# EAGLE design carlos_reg_psu (EAGLE 7.3.0)
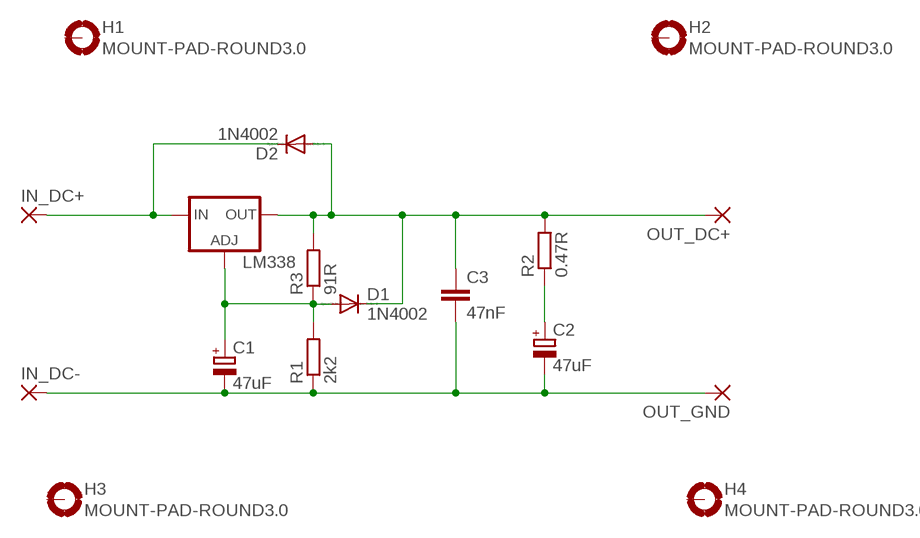
[diagram p0: schematic, sheet 1]

## Parts
C1  47uF  CPOL-EUE5-13  [E5-13]
C2  47uF  CPOL-EUE5-13  [E5-13]
C3  47nF  C-EU050-030X075  [C050-030X075]
D1  1N4002  1N4004  [DO41-10]
D2  1N4002  1N4004  [DO41-10]
H1  MOUNT-PAD-ROUND3.0  [3,0-PAD]
H2  MOUNT-PAD-ROUND3.0  [3,0-PAD]
H3  MOUNT-PAD-ROUND3.0  [3,0-PAD]
H4  MOUNT-PAD-ROUND3.0  [3,0-PAD]
IN_DC+  2,54/1,0  [2,54/1,0]
IN_DC-  2,54/1,0  [2,54/1,0]
LM338  LM317TS  [317TS]
OUT_DC+  2,54/1,0  [2,54/1,0]
OUT_GND  2,54/1,0  [2,54/1,0]
R1  2k2  R-EU_0414/5V  [0414V]
R2  0.47R  R-EU_0414/5V  [0414V]
R3  91R  R-EU_0414/5V  [0414V]

## Nets
N$1: C2.+ R2.1
N$2: C1.+ D1.A LM338.1(ADJ) R1.2 R3.1
N$3: C3.1 D1.C D2.A LM338.2(OUT) OUT_DC+.1(P) R2.2 R3.2
N$4: D2.C IN_DC+.1(P) LM338.3(IN)
N$6: C1.- C2.- C3.2 IN_DC-.1(P) OUT_GND.1(P) R1.1
Unconnected: H1.B3,0(MOUNT) H2.B3,0(MOUNT) H3.B3,0(MOUNT) H4.B3,0(MOUNT)

## Library data of the parts
C1 C2 = resistor:CPOL-EU: POLARIZED CAPACITOR, European symbol
C3 = rcl:C-EU: CAPACITOR, European symbol
D1 D2 = diode:1N4004: DIODE general purpose rectifier, 1 A
H1-H4 = holes:MOUNT-PAD-ROUND: MOUNTING PAD, round
IN_DC+ IN_DC- OUT_DC+ OUT_GND = wirepad:2,54/1,0: THROUGH-HOLE PAD
LM338 = v-reg:LM317TS: VOLTAGE REGULATOR
R1-R3 = resistor:R-EU_: RESISTOR, European symbol

## Board
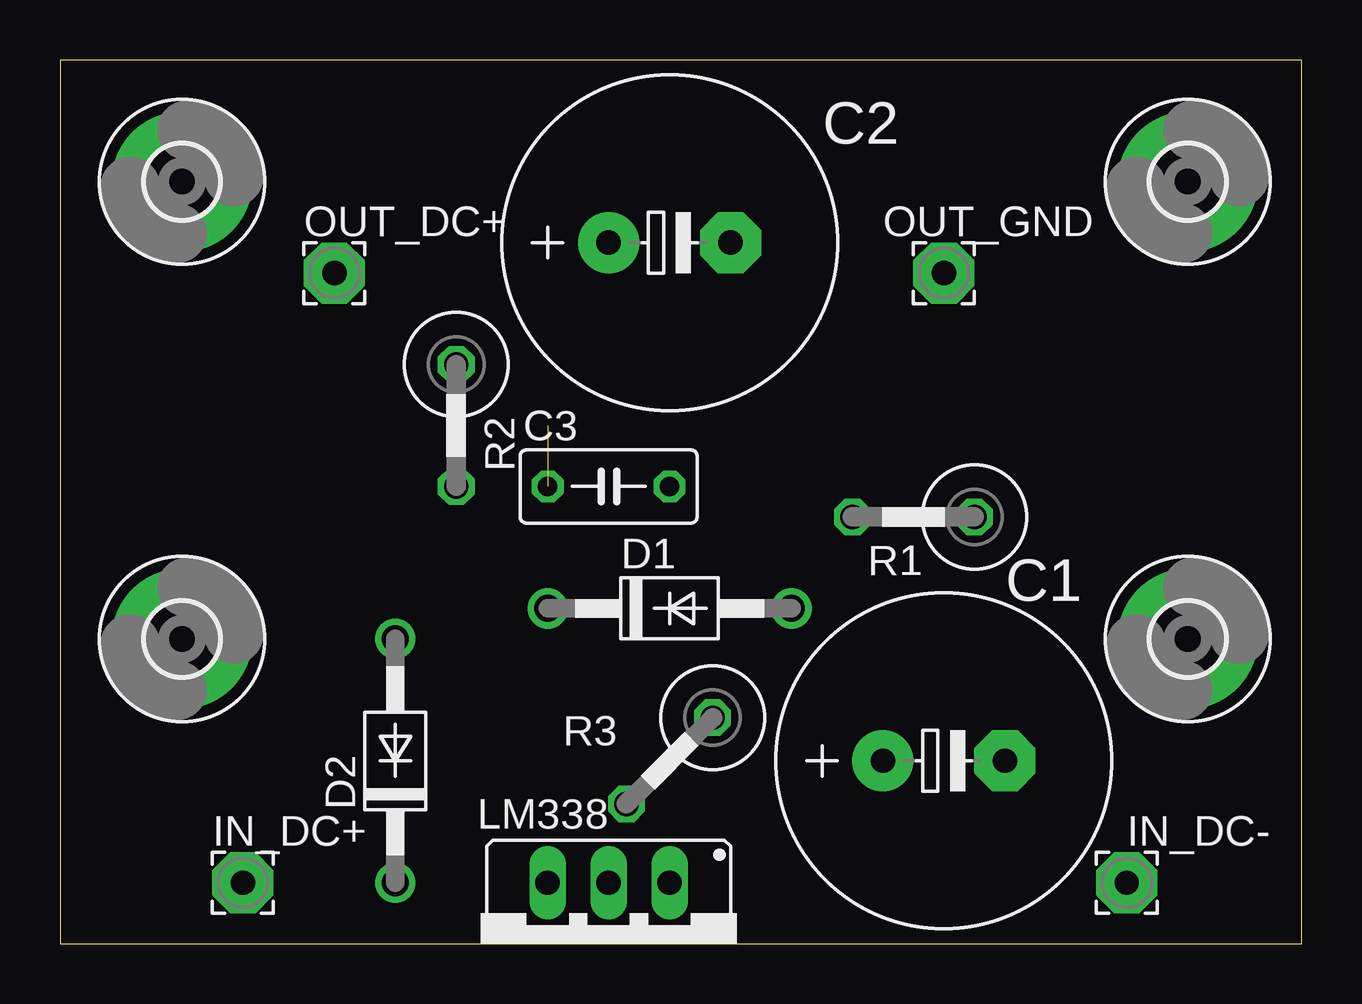
[diagram p1: board, top side]
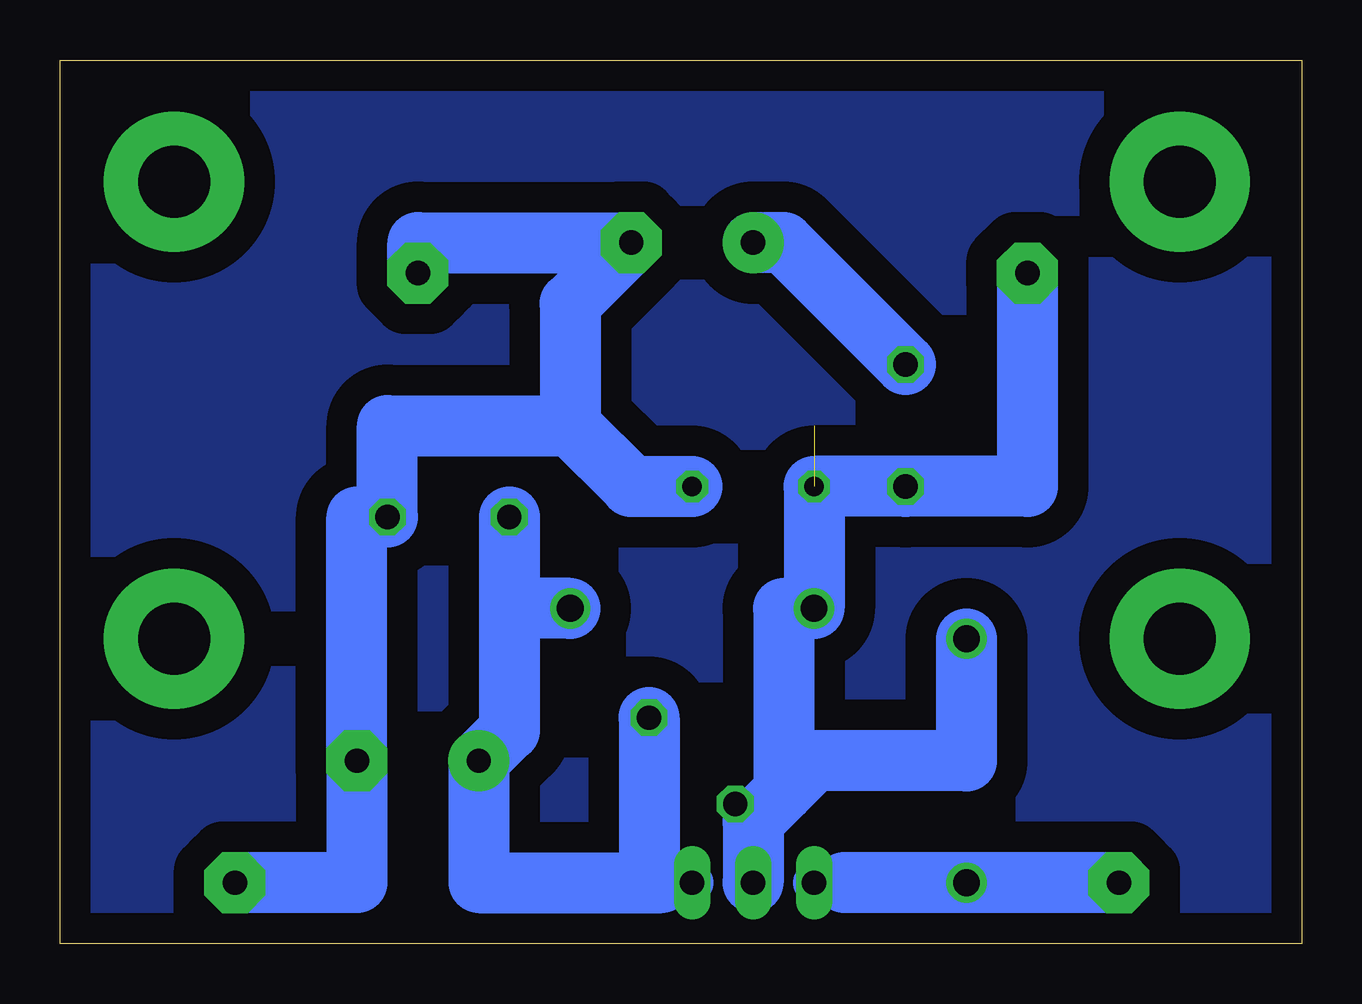
[diagram p2: board, bottom side, seen from below]

Size 51.74 x 36.82 mm. Coordinates in mm from the lower left corner, seen from the top.
Outline: 0,0 51.74,0 51.74,36.82 0,36.82 0,0
Copper layers (1*16): Top 0.035mm / dielectric 1.5mm / Bottom 0.035mm
Design rules "default": minimum track width 10mil, minimum drill 24mil, track to track 8mil, track to pad 8mil, pad to pad 8mil, via to via 8mil, smd to smd 8mil, copper to edge 40mil, drill to drill 8mil, minimum pad ring 10mil, minimum via ring 8mil, stop-mask expansion 4mil, vias tented up to drill 0mil, thermal gap 10mil

### Footprints (pad centres in the part's own frame; a part is rotated, then mirrored left to right if it is on the bottom)
E5-13 = drill 1.016 pad 2.54: + -2.54,0 | drill 1.016 pad 2.54 octagon: - 2.54,0
C050-030X075 = drill 0.813 octagon: 1 -2.54,0; 2 2.54,0
DO41-10 = drill 1.118: A 5.08,0; C -5.08,0
3,0-PAD = drill 3 pad 5.842: B3,0 0,0
2,54/1,0 = drill 1.016 pad 2.54 octagon: 1 0,0
317TS = drill 1.016 long: 1 -2.54,-2.54; 2 0,-2.54; 3 2.54,-2.54
0414V = drill 1.016 octagon: 1 -2.54,0; 2 2.54,0

### Placement (x,y rotation side)
C1  36.83,7.62 0 top
C2  25.4,29.21 0 top
C3  22.86,19.05 0 top
D1  25.4,13.97 0 top
D2  13.97,7.62 90 top
H1  46.99,12.7 0 top
H2  5.08,12.7 0 top
H3  46.99,31.75 0 top
H4  5.08,31.75 0 top
IN_DC+  7.62,2.54 0 top
IN_DC-  44.45,2.54 0 top
LM338  22.86,0 180 top
OUT_DC+  11.43,27.94 0 top
OUT_GND  36.83,27.94 0 top
R1  35.56,17.78 180 top
R2  16.51,21.59 270 top
R3  25.4,7.62 225 top

### Tracks (layer width: path | path; a pad name or v marks a point on that pad's centre or on a via)
GND
  pour Bottom (isolate 1.27): 0,0 52.07,0 52.07,36.83 0,36.83
N$1
  Bottom 2.54: R2.1 21.59,29.21 C2.+
N$2
  Bottom 1.778: LM338.1 26.67,2.54
  Bottom 2.54: 27.94,2.54 34.29,2.54 C1.+ 33.02,8.89 33.02,13.97 | 27.94,2.54 26.67,2.54 | R1.2 33.02,13.97 | D1.A 33.02,13.97 | R3.1 27.2,3.28 27.94,2.54
N$3  (1 unrouted)
  Bottom 1.27: 22.86,5.08 23.08,5.08 R3.2
  Bottom 2.54: D2.A 13.97,7.62 20.32,7.62 21.59,6.35 | 21.59,6.35 22.86,5.08 LM338.2 | 21.59,6.35 21.59,13.97 D1.C C3.1 R2.2 11.43,19.05 OUT_DC+.1
N$4
  Bottom 1.778: 19.05,2.54 LM338.3 D2.C
  Bottom 2.54: IN_DC+.1 D2.C 19.05,2.54
N$6
  Bottom 2.54: IN_DC-.1 39.37,2.54 C1.- 39.37,17.78 R1.1 38.1,21.59 30.48,21.59 | 30.48,21.59 27.94,19.05 C3.2 | 30.48,21.59 30.48,26.67 C2.- 36.83,29.21 OUT_GND.1